# EAGLE design plugbrd4 (EAGLE 6.5.0)
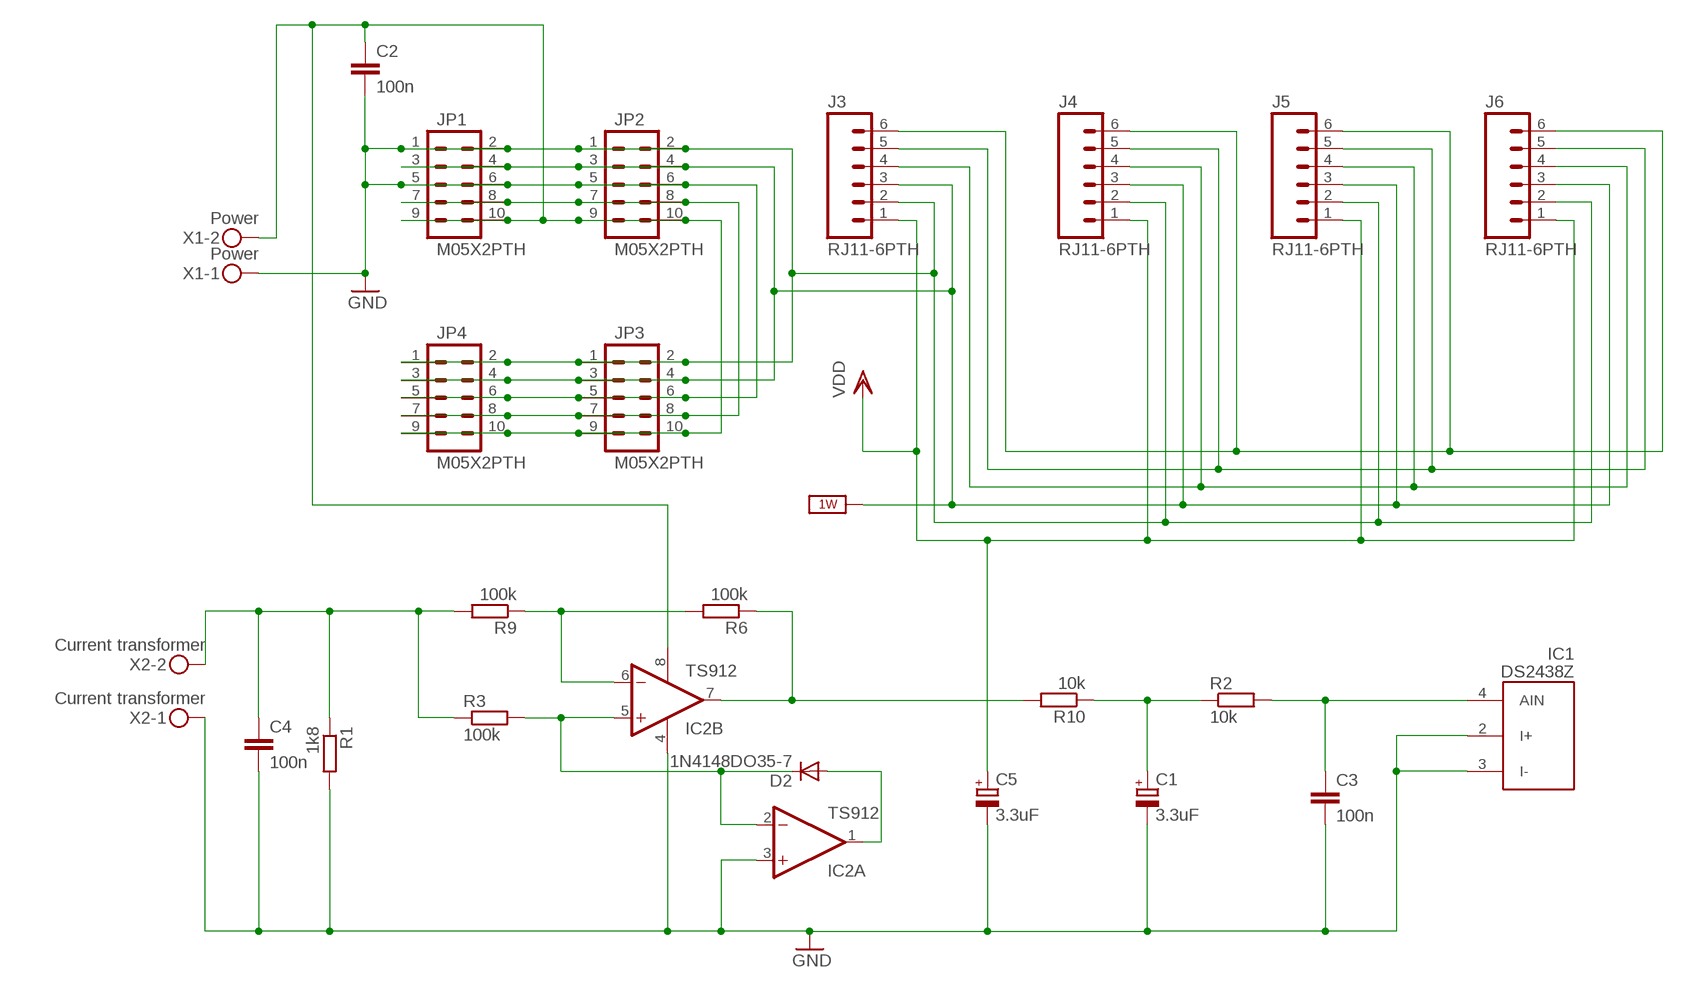
[diagram p0: schematic, sheet 1]

## Parts
C1  3.3uF  CPOL-EUE5-6  [E5-6]
C2  100n  C-EU050-025X075  [C050-025X075]
C3  100n  C-EU050-025X075  [C050-025X075]
C4  100n  C-EU050-025X075  [C050-025X075]
C5  3.3uF  CPOL-EUE5-6  [E5-6]
D2  1N4148DO35-7  [DO35-7]
IC1  DS2438Z  [SO08]
IC2  TS912  2AMP_P8+4D  [SO08]
J3  RJ11-6PTH  [RJ11-6]
J4  RJ11-6PTH  [RJ11-6]
J5  RJ11-6PTH  [RJ11-6]
J6  RJ11-6PTH  [RJ11-6]
JP1  M05X2PTH  [AVR_ICSP]
JP2  M05X2PTH  [AVR_ICSP]
JP3  M05X2PTH  [AVR_ICSP]
JP4  M05X2PTH  [AVR_ICSP]
R1  1k8  R-EU_0207/12  [0207/12]
R2  10k  R-EU_0207/12  [0207/12]
R3  100k  R-EU_0207/12  [0207/12]
R6  100k  R-EU_0207/12  [0207/12]
R9  100k  R-EU_0207/12  [0207/12]
R10  10k  R-EU_0207/12  [0207/12]
X1  Power  MKDSN1,5/2-5,08  [MKDSN1,5/2-5,08]
X2  Current transformer  MKDSN1,5/2-5,08  [MKDSN1,5/2-5,08]

## Nets
1W: J3.3 J4.3 J5.3 J6.3 JP1.3 JP1.4 JP2.3 JP2.4 JP3.3 JP3.4 JP4.3 JP4.4 ; supply symbol labelled 1W_SUP
GND: C1.- C2.2 C3.2 C4.2 C5.- IC1.2(I+) IC1.3(I-) IC2.3(A:+IN) IC2.4(P:V-) J3.2 J4.2 J5.2 J6.2 JP1.1 JP1.2 JP1.5 JP1.6 JP2.1 JP2.2 JP2.5 JP2.6 JP3.1 JP3.2 JP3.5 JP3.6 JP4.1 JP4.2 JP4.5 JP4.6 R1.2 X1.1 X2.1
N$1: C1.+ R2.1 R10.1
N$2: JP1.7 JP1.8 JP2.7 JP2.8 JP3.7 JP3.8 JP4.7 JP4.8
N$3: D2.A IC2.1(A:OUT)
N$4: J3.4 J4.4 J5.4 J6.4
N$5: J3.5 J4.5 J5.5 J6.5
N$6: J3.6 J4.6 J5.6 J6.6
N$7: IC2.7(B:OUT) R6.1 R10.2
N$8: IC2.6(B:-IN) R6.2 R9.1
N$9: C4.1 R1.1 R3.1 R9.2 X2.2
N$10: C2.1 IC2.8(P:V+) JP1.9 JP1.10 JP2.9 JP2.10 JP3.9 JP3.10 JP4.9 JP4.10 X1.2
N$11: C3.1 IC1.4(AIN) R2.2
N$16: D2.C IC2.2(A:-IN) IC2.5(B:+IN) R3.2
VDD: C5.+ J3.1 J4.1 J5.1 J6.1

## Power pins joined to a net without a drawn wire
1W: IC1.8(1W)
GND: IC1.1(GND)
VDD: IC1.5(VDD)

## Library data of the parts
C1 C5 = rcl:CPOL-EU: POLARIZED CAPACITOR, European symbol
C2-C4 = rcl:C-EU: CAPACITOR, European symbol
D2 = diode:1N4148: DIODE high speed (Philips)
IC1 = 1wire:DS2438: Smart Battery Monitor This is an A/D converter, temperature sensor, EEPROM in one chip. One may mount it directly into the battery pack to monitor temperature and voltage of. The chip can monitor the loading of the battery through its current sensor pins, too. An additional A/D pin may be connected to additonal external circuit. Notes: This chip is a little more sophisticated than the DS2436. Please read the datasheet. The DS2436 is a similar chip with less features. Author: Jan Kandziora <jjj@gmx.de>
IC2 = linear:2AMP_P8+4: OP AMP
J3-J6 = SparkFun:RJ11-6: RJ11 Jack Simple 6 pin RJ11 jack. Commonly found on CAT3 devices and Microchip programmers. SKU: PRT-00132
JP1-JP4 = SparkFun:M05X2: Header 5x2 Standard 10-pin dual row 0.1" header. Commonly used with AVR-ISP. Use with Spark Fun Electronics SKU: PRT-00778
R1-R3 R6 R9 R10 = rcl:R-EU_: RESISTOR, European symbol
X1 X2 = con-phoenix-508:MKDSN1,5/2-5,08: MKDSN 1,5/ 2-5,08 Printklemme Nennstrom: 13,5 A Nennspannung: 250 V Rastermaß: 5,08 mm Polzahl: 2 Anschlussart: Schraubanschluss Montage: Löten Anschlussrichtung Leiter/Platine: 0 ° Artikelnummer: 1729128 Source: http://eshop.phoenixcontact.com .. 1729128.pdf

## Board
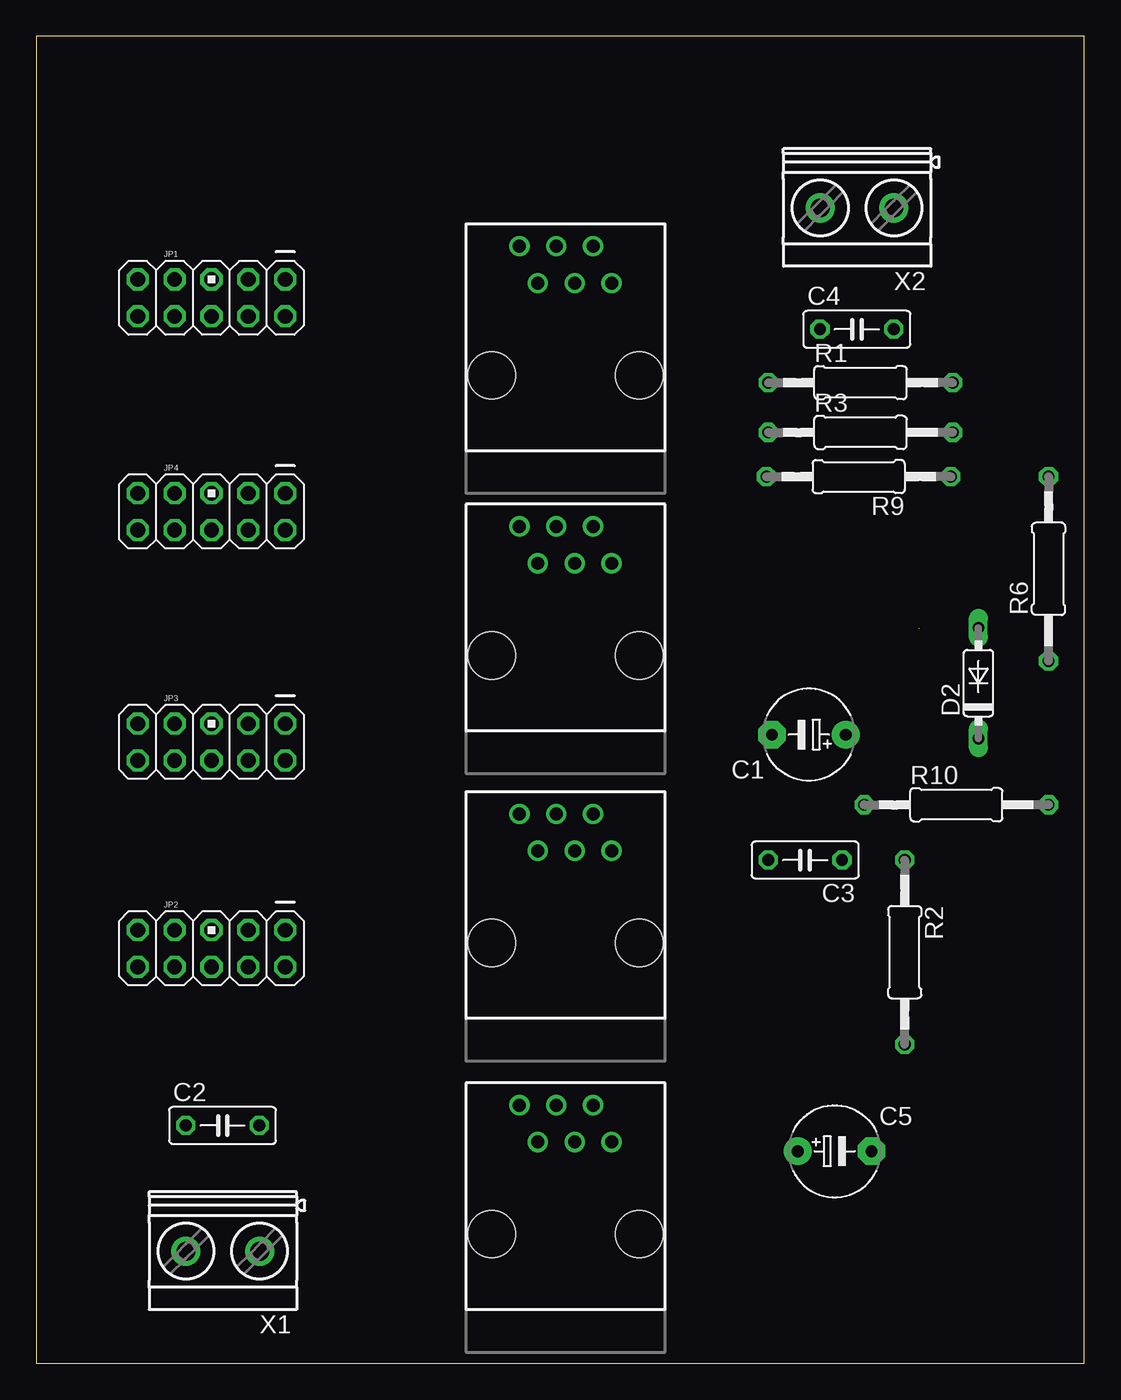
[diagram p1: board, top side]
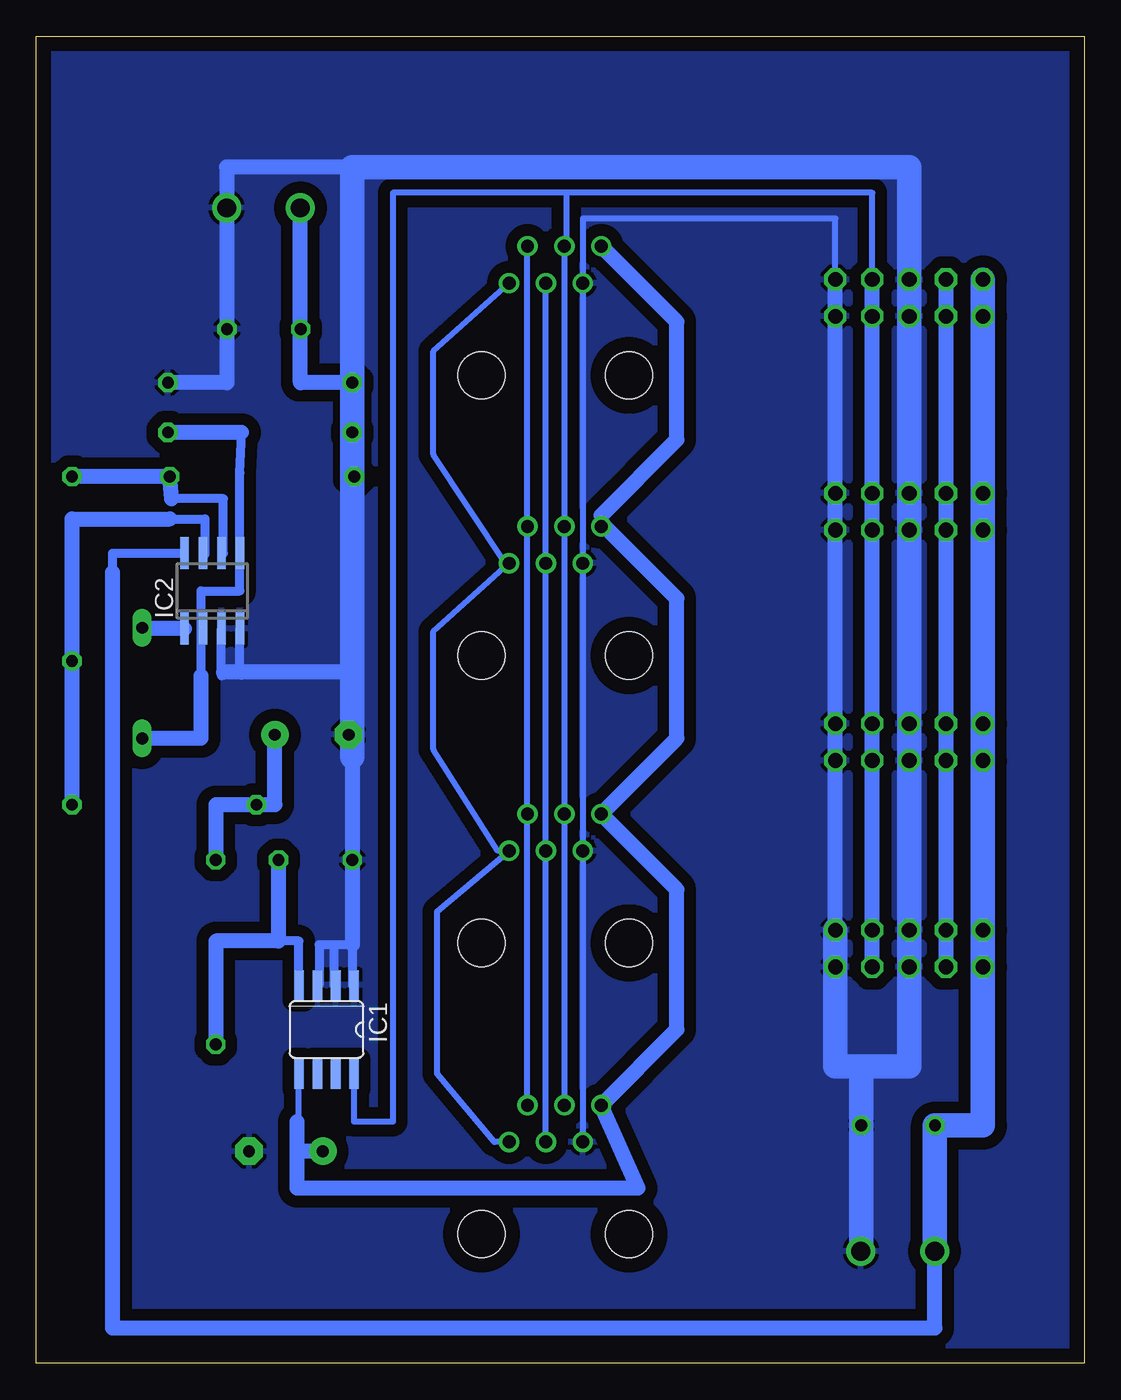
[diagram p2: board, bottom side, seen from below]

Size 72.19 x 91.43 mm. Coordinates in mm from the lower left corner, seen from the top.
Outline: 0,0 72.19,0 72.19,91.43 0,91.43 0,0
Copper layers (1*16): Top 0.035mm / dielectric 1.5mm / Bottom 0.035mm
Design rules "default": minimum track width 10mil, minimum drill 24mil, track to track 8mil, track to pad 8mil, pad to pad 8mil, via to via 8mil, smd to smd 8mil, copper to edge 40mil, drill to drill 8mil, minimum pad ring 10mil, minimum via ring 8mil, stop-mask expansion 4mil, vias tented up to drill 0mil, thermal gap 10mil

### Footprints (pad centres in the part's own frame; a part is rotated, then mirrored left to right if it is on the bottom)
E5-6 = drill 0.813 pad 1.905: + -2.54,0 | drill 0.813 pad 1.905 octagon: - 2.54,0
C050-025X075 = drill 0.813 octagon: 1 -2.54,0; 2 2.54,0
DO35-7 = drill 0.813 long: A 3.81,0; C -3.81,0
SO08 = smd 0.66 x 2.032: 1 -1.905,-3.073; 2 -0.635,-3.073; 3 0.635,-3.073; 4 1.905,-3.073; 5 1.905,3.073; 6 0.635,3.073; 7 -0.635,3.073; 8 -1.905,3.073
SO08' = smd 0.6 x 2.2: 1 -1.905,-2.6; 2 -0.635,-2.6; 3 0.635,-2.6; 4 1.905,-2.6; 5 1.905,2.6; 6 0.635,2.6; 7 -0.635,2.6; 8 -1.905,2.6
RJ11-6 = drill 0.889: 1 1.905,8.89; 2 3.175,6.35; 3 4.445,8.89; 4 5.715,6.35; 5 6.985,8.89; 6 8.255,6.35 | hole 3.251: 0,0; 10.16,0
AVR_ICSP = drill 1.016 octagon: 1 -1.27,5.08; 2 1.27,5.08; 3 -1.27,2.54; 4 1.27,2.54; 5 -1.27,0; 6 1.27,0; 7 -1.27,-2.54; 8 1.27,-2.54; 9 -1.27,-5.08; 10 1.27,-5.08
0207/12 = drill 0.813 octagon: 1 -6.35,0; 2 6.35,0
MKDSN1,5/2-5,08 = drill 1.3 pad 2: 1 -2.561,0.025; 2 2.519,0.025

### Placement (x,y rotation side)
C1  53.21,43.31 180 top
C2  12.83,16.38 0 top
C3  52.96,34.67 180 top
C4  56.52,71.25 0 top
C5  54.99,14.61 0 top
D2  64.9,46.86 90 top
IC1  52.2,22.99 180 bottom
IC2  TS912  [SO08']  60.07,53.21 0 bottom
J3  31.37,28.96 0 top
J4  31.37,8.89 0 top
J5  31.37,48.77 0 top
J6  31.37,68.07 0 top
JP1  12.07,73.41 270 top
JP2  12.07,28.57 270 top
JP3  12.07,42.8 270 top
JP4  12.07,58.67 270 top
R1  56.77,67.56 0 top
R2  59.82,28.32 270 top
R3  56.77,64.13 0 top
R6  69.72,54.74 90 top
R9  56.64,61.09 180 top
R10  63.37,38.48 0 top
X1  12.83,7.75 180 top
X2  56.52,79.63 180 top

### Tracks (layer width: path | path; a pad name or v marks a point on that pad's centre or on a via)
1W
  Bottom 0.408: J4.3 J3.3 J5.3 J6.3 35.69,76.96 35.69,80.64 | JP4.4 14.61,80.64 35.69,80.64 | IC1.8 50.29,16.64 47.62,16.64 47.62,80.64 35.69,80.64
  Bottom 1.016: JP2.4 JP2.3 JP3.4 JP3.3 JP4.4 JP4.3 JP1.4 JP1.3
GND
  Bottom 0.408: JP1.1 17.14,78.87 34.54,78.87 J6.2 J5.2 J3.2 J4.2 | X1.1 15.37,7.72
  Bottom 0.61: IC2.3 59.44,47.37 59.31,47.62 | IC2.4 58.17,47.62 58.04,47.62 | IC1.3 52.71,26.06 52.71,28.83 51.69,28.83 | 51.69,28.83 50.42,28.83 50.42,26.06 IC1.1 | IC1.2 51.69,26.06 51.69,28.83
  Bottom 1.016: JP2.1 JP3.2 JP3.1 JP4.2 JP4.1 JP1.2 JP1.1 | 50.42,82.42 59.08,82.42 X2.1 59.05,79.6 C4.2 59.05,67.56 R1.2 | C1.- 50.42,41.78 C3.2 50.42,28.83 | 50.42,47.62 58.04,47.62 59.31,47.62
  Bottom 1.676: JP2.1 JP2.2 17.14,20.45 15.37,20.45 | JP2.6 JP2.5 JP3.6 JP3.5 JP4.6 JP4.5 JP1.6 JP1.5 | JP1.5 12.07,20.45 15.37,20.45 | 15.37,20.45 C2.2 15.37,7.72 | 50.42,41.78 50.42,47.62 50.42,82.42 12.07,82.42 JP1.5
  pour Bottom (isolate 0.813): 0.51,90.93 71.75,91.06 71.88,0.76 0.76,0.51
N$1
  Bottom 1.016: C1.+ 55.75,38.48 R10.1 59.82,38.48 R2.1
N$2
  Bottom 0.406: JP1.7 JP1.8
  Bottom 1.016: JP1.7 JP4.7 JP4.8 JP3.7 JP3.8 JP2.7 JP2.8 9.65,27.3
N$3
  Bottom 1.016: D2.A 64.9,50.61 IC2.1
N$4
  Bottom 0.408: J6.4 J5.4 J3.4 J4.4
N$5
  Bottom 0.408: J6.5 J5.5 J3.5 J4.5
N$6
  Bottom 0.408: J6.6 44.83,69.72 44.83,62.61 39.88,55.12 J5.6 44.83,50.42 44.83,42.29 40.39,35.31 J3.6 44.58,31.11 44.58,19.94 40.64,15.24 J4.6
N$7
  Bottom 0.61: 62.99,58.17 60.58,58.17 60.58,55.75 IC2.7
  Bottom 1.016: 62.99,58.17 69.72,58.17 R6.1 R10.2
N$8
  Bottom 0.61: IC2.6 59.31,55.81 59.31,59.56 62.87,59.56
  Bottom 1.016: 62.87,59.56 R9.1 R6.2
N$9
  Bottom 0.813: 54,71.25 C4.1
  Bottom 1.016: X2.2 54,71.25 54,67.56 R1.1 R3.1 50.42,61.09 R9.2 50.16,61.09
N$10
  Bottom 0.61: IC2.8 66.93,55.81 66.93,54.48
  Bottom 1.016: 66.93,54.48 66.93,2.41 10.29,2.41 10.29,7.72
  Bottom 1.676: JP1.9 JP1.10 JP4.9 JP4.10 JP3.9 JP3.10 JP2.9 JP2.10 6.98,16.38 C2.1 10.29,7.72 X1.2
N$11
  Bottom 0.61: IC1.4 54.1,29.08 55.5,29.08
  Bottom 1.016: C3.1 55.5,29.08 59.82,29.08 R2.2
N$16  (1 unrouted)
  Bottom 0.61: IC2.2 60.83,50.61 60.83,47.37 | 60.83,50.67 60.83,53.21 58.17,53.21 IC2.5 58.17,61.34 58.04,64.13
  Bottom 1.016: D2.C 60.83,43.05 60.83,47.37 | 58.04,64.13 R3.2
VDD
  Bottom 0.408: 33.27,58.42 J5.1 33.02,57.66 | 54.23,16.64 54.1,16.64 IC1.5
  Bottom 1.016: J6.1 28.07,71.75 28.07,63.63 33.27,58.42 | 33.02,57.66 28.07,52.71 28.07,43.05 J3.1 28.07,32.64 28.07,22.99 J4.1 30.73,12.07 54.23,12.07 54.23,14.35 54.23,14.61 | 54.23,14.61 54.23,16.64 | C5.+ 54.23,14.61